# EAGLE design 3w developer v2 (EAGLE 5.10)
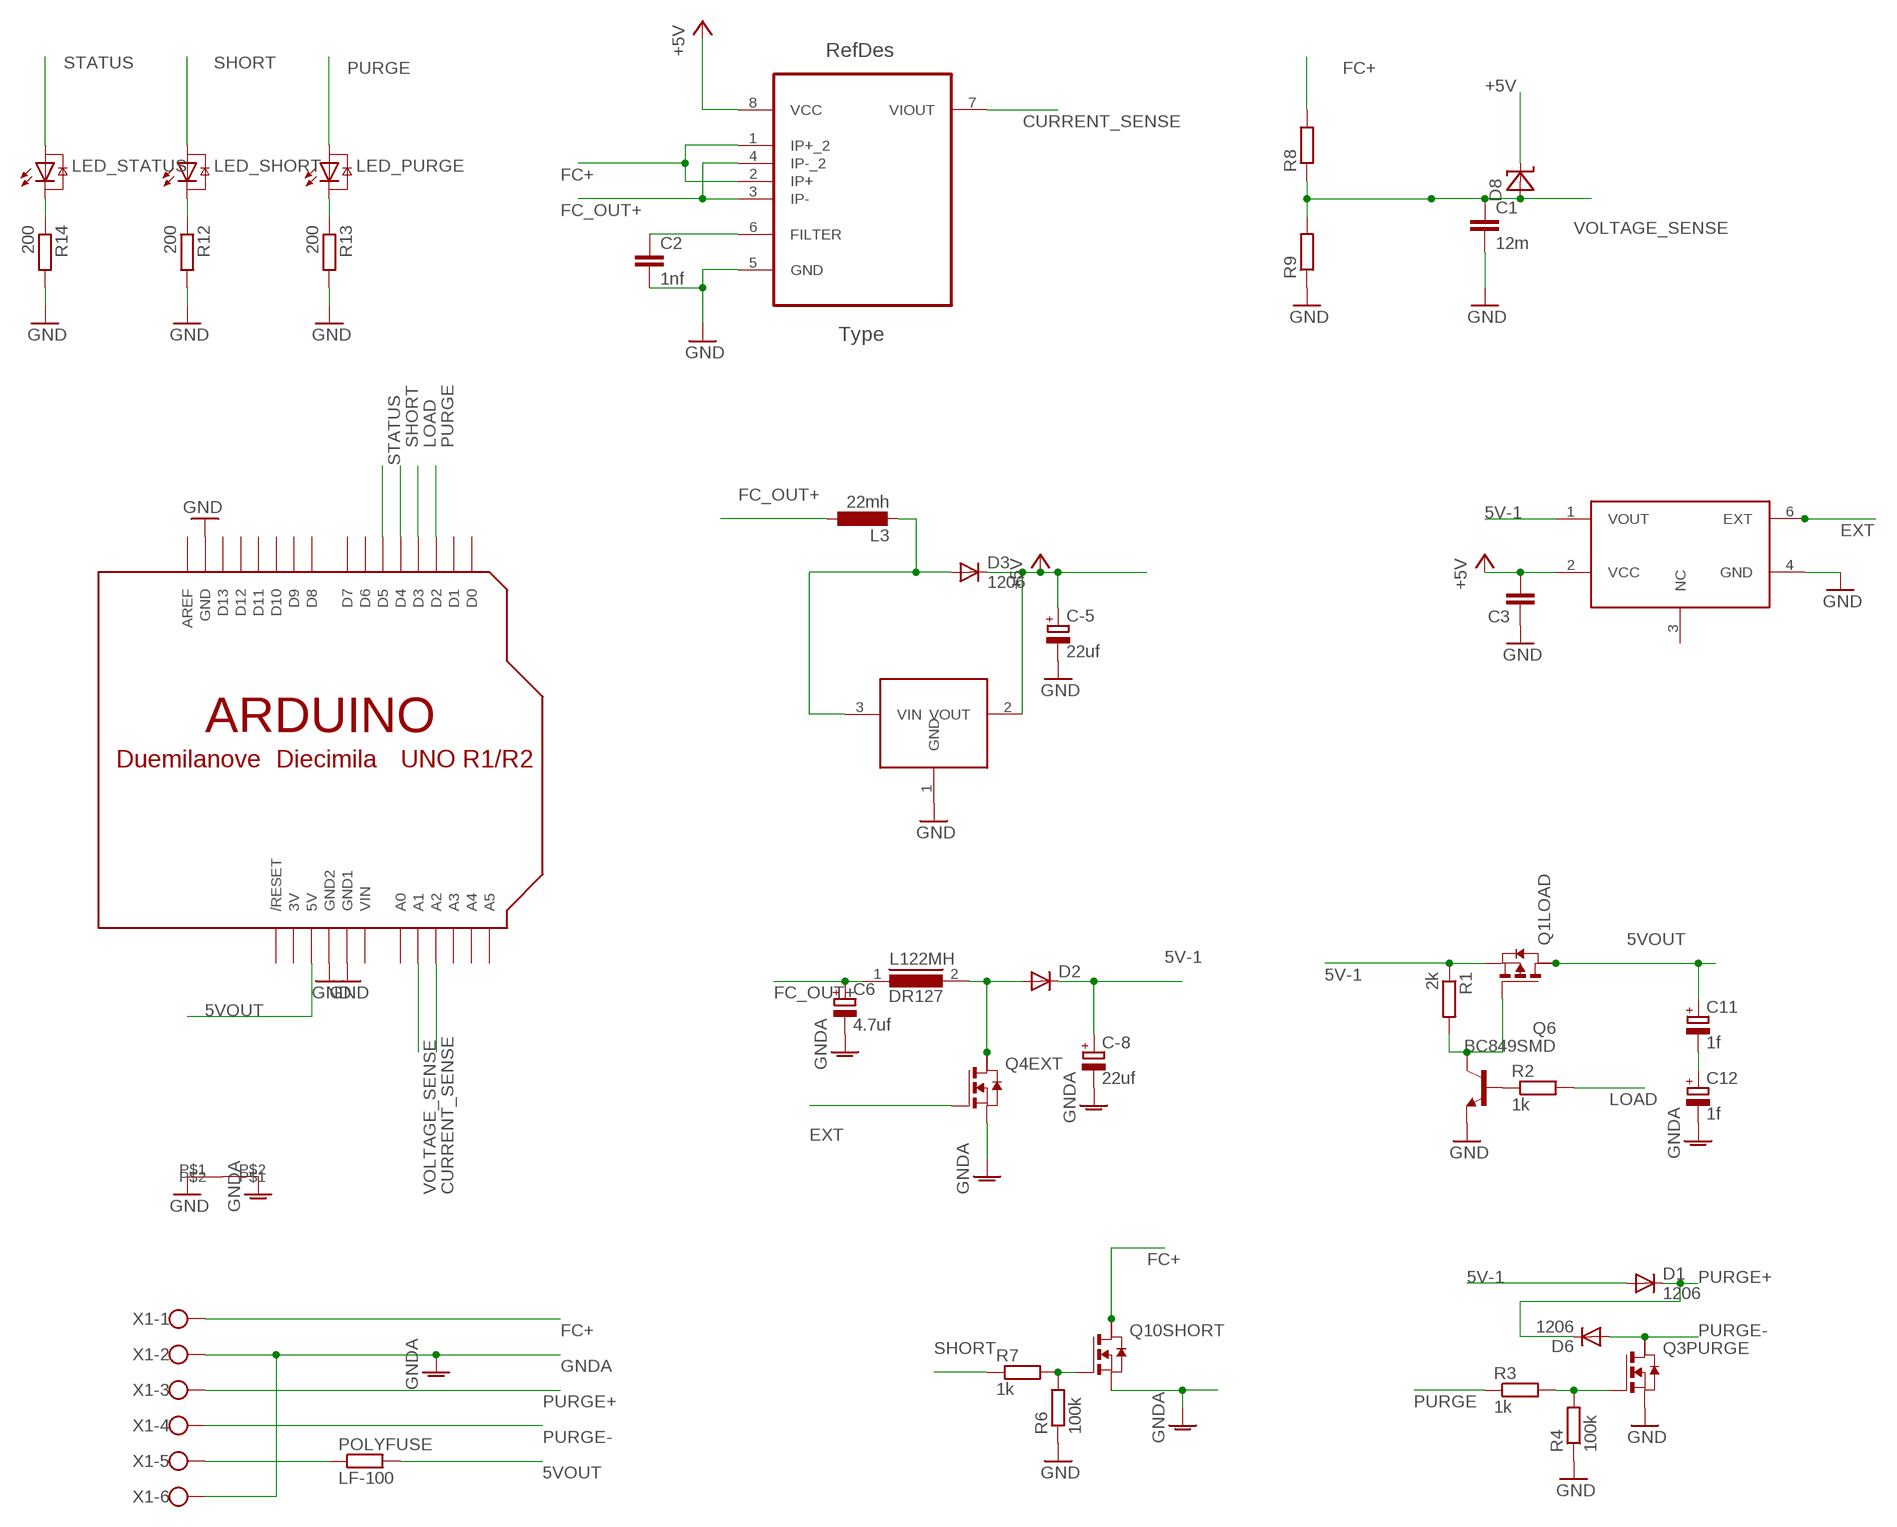
[diagram p0: schematic, sheet 1]

## Parts
C1  12m  C-EUC1206  [C1206]
C2  1nf  C-EUC1206  [C1206]
C3  C-EUC1206  [C1206]
C6  4.7uf  CPOL-EUSMCC  [SMC_C]
C11  1f  CPOL-EUE5-10.5  [E5-10,5]
C12  1f  CPOL-EUE5-10.5  [E5-10,5]
C-5  22uf  CPOL-EUSMCD  [SMC_D]
C-8  22uf  CPOL-EUSMCD  [SMC_D]
D1  1206  DIODE-GF1  [GF1]
D2  DIODE-DO214AA  [DO214AA]
D3  1206  DIODE-DO214AA  [DO214AA]
D6  1206  DIODE-GF1  [GF1]
D8  1206ZENER  [C1206]
L3  22mh  L-EU  [MURATA-45223]
L122MH  DR127  [DR127]
LED_PURGE  GM5BW96385A  [GM5BW96385A]
LED_SHORT  GM5BW96385A  [GM5BW96385A]
LED_STATUS  GM5BW96385A  [GM5BW96385A]
POLYFUSE  LF-100  [LF100]
Q1LOAD  PMOSSOT223  [SOT223]
Q3PURGE  NMOSSOT223  [SOT223]
Q4EXT  NMOSSOT223  [SOT223]
Q6  BC849SMD  [SOT23-BEC]
Q10SHORT  NMOSSOT223  [SOT223]
R1  2k  R-EU_M1206  [M1206]
R2  1k  R-EU_M1206  [M1206]
R3  1k  R-EU_M1206  [M1206]
R4  100k  R-EU_M1206  [M1206]
R6  100k  R-EU_M1206  [M1206]
R7  1k  R-EU_M1206  [M1206]
R8  R-EU_R1206  [R1206]
R9  R-EU_R1206  [R1206]
R12  200  R-EU_M1206  [M1206]
R13  200  R-EU_M1206  [M1206]
R14  200  R-EU_M1206  [M1206]
U1  ACS712ELCTR-05B-T  [SOIC127P600X175-8N]
U$1  MINIPAK-E50  [SOT23-6]
U$2  MINIPAK-7750  [SOT89]
U$3  ARDUINO-NOHOLE  [ARDUINO-NOHOLE]
U$4  SHORT  [SHORT]
X1  W237-6  [W237-6]

## Nets
5V-1: C-8.+ D1.A D2.C Q1LOAD.3(S) R1.1 U$1.1(VOUT)
5VOUT [power]: C11.+ POLYFUSE.P$4 Q1LOAD.2(D) U$3.5V
+5V [medpower]: C3.2 C-5.+ D3.C D8.CATHODE(C) U1.8(VCC) U$1.2(VCC) U$2.2(VOUT)
CURRENT_SENSE: U1.7(VIOUT) U$3.A2
EXT: Q4EXT.1(G) U$1.6(EXT)
FC+ [power]: Q10SHORT.2(D) R8.2 U1.1(IP+_2) U1.2(IP+) X1.1
FC_OUT+ [power]: C6.+ L3.P$1 L122MH.1 U1.3(IP-) U1.4(IP-_2)
GND: C1.2 C2.2 C3.1 C-5.- Q3PURGE.3(S) Q6.E R4.1 R6.1 R9.1 R12.2 R13.2 R14.2 U1.5(GND) U$1.4(GND) U$2.1(GND) U$3.GND U$3.GND1 U$3.GND2 U$4.P$1
GNDA [power]: C6.- C12.- C-8.- Q4EXT.3(S) Q10SHORT.3(S) U$4.P$2 X1.2 X1.6
LOAD: R2.2 U$3.D3
N$1: Q10SHORT.1(G) R6.2 R7.2
N$2: Q1LOAD.1(G) Q6.C R1.2
N$3: D2.A L122MH.2 Q4EXT.2(D)
N$5: Q6.B R2.1
N$6: D3.A L3.P$2 U$2.3(VIN)
N$7: Q3PURGE.1(G) R3.2 R4.2
N$8 [power]: C11.- C12.+
N$9: C2.1 U1.6(FILTER)
N$10 [power]: POLYFUSE.P$3 X1.5
N$14: LED_SHORT.C R12.1
N$15: LED_PURGE.C R13.1
N$16: LED_STATUS.C R14.1
PURGE: LED_PURGE.A R3.1 U$3.D2
PURGE+ [medpower]: D1.C D6.C X1.3
PURGE- [medpower]: D6.A Q3PURGE.2(D) X1.4
SHORT: LED_SHORT.A R7.1 U$3.D4
STATUS: LED_STATUS.A U$3.D5
VOLTAGE_SENSE: C1.1 D8.ANODE(A) R8.1 R9.2 U$3.A1
Unconnected: Q1LOAD.4(D2) Q3PURGE.4(D2) Q4EXT.4(D2) Q10SHORT.4(D2) U$1.3(NC) U$3.A0 U$3.A3 U$3.A4 U$3.A5 U$3.AREF U$3.D0 U$3.D1 U$3.D6 U$3.D7 U$3.D8 U$3.D9 U$3.D10 U$3.D11 U$3.D12 U$3.D13 U$3.RESET(/RESET)

## Power pins joined to a net without a drawn wire
3V: U$3.3V
VIN: U$3.VIN

## Library data of the parts
C1-C3 = matt rcl:C-EU: CAPACITOR, European symbol
C6 = rcl:CPOL-EU: POLARIZED CAPACITOR, European symbol
C11 C12 C-5 C-8 = matt rcl:CPOL-EU: POLARIZED CAPACITOR, European symbol
D1-D3 D6 = matt diode:DIODE-: DIODE
D8 = matt diode:1206ZENER
L3 = matt rcl:L-EU: INDUCTOR, European symbol
L122MH = inductors:DR127: High Power Density, High Efficiency, Shielded Inductors Source: coiltronics_dr_series.pdf
LED_PURGE LED_SHORT LED_STATUS = matt led:GM5BW96385A: High brightness White Color LED 2300 mcd @ IF = 20mA achieved via InGaN Blue LED chip in combination with Yellow Phosphor Source: http://document.sharpsma.com/files/GM5BW96385A.pdf
POLYFUSE = matt rcl:LF-100: polyfuse lf100 littelfuse
Q1LOAD = zetex:PMOSSOT223: MOS FET
Q3PURGE Q4EXT Q10SHORT = zetex:NMOSSOT223: MOS FET
Q6 = matt transistor-npn:BC849*: NPN Transistor
R1-R4 R6 R7 R12-R14 = resistor:R-EU_: RESISTOR, European symbol
R8 R9 = matt rcl:R-EU_: RESISTOR, European symbol
U1 = matt-allegro:ACS712ELCTR-05B-T: Linear Current Sensor; DESCRIPTION: Linear Current Sensor; MPN: ACS712ELCTR-05B-T; OC_FARNELL: 27M3644; OC_NEWARK: 1329623; PACKAGE: SOIC-8; SUPPLIER: Allegro
U$1 = matt:MINIPAK-E50
U$2 = matt:MINIPAK-7750
U$3 = adafruit:ARDUINO: Arduino Diecimila/Duemilanove Make a shield with ease, this package has all the named pins as well as the two mounting drill holes and an outline of the USB and DC power connector. The outline is on the DIMENSION layer, so if your board house uses it they will cut the outline to match. http://www.ladyada.net/library/pcb/eaglelibrary.html
U$4 = matt:SHORT
X1 = con-wago-500:W237-6: WAGO SCREW CLAMP

## Net classes
1 power: width 3 mm
2 medpower: width 1 mm

## Board
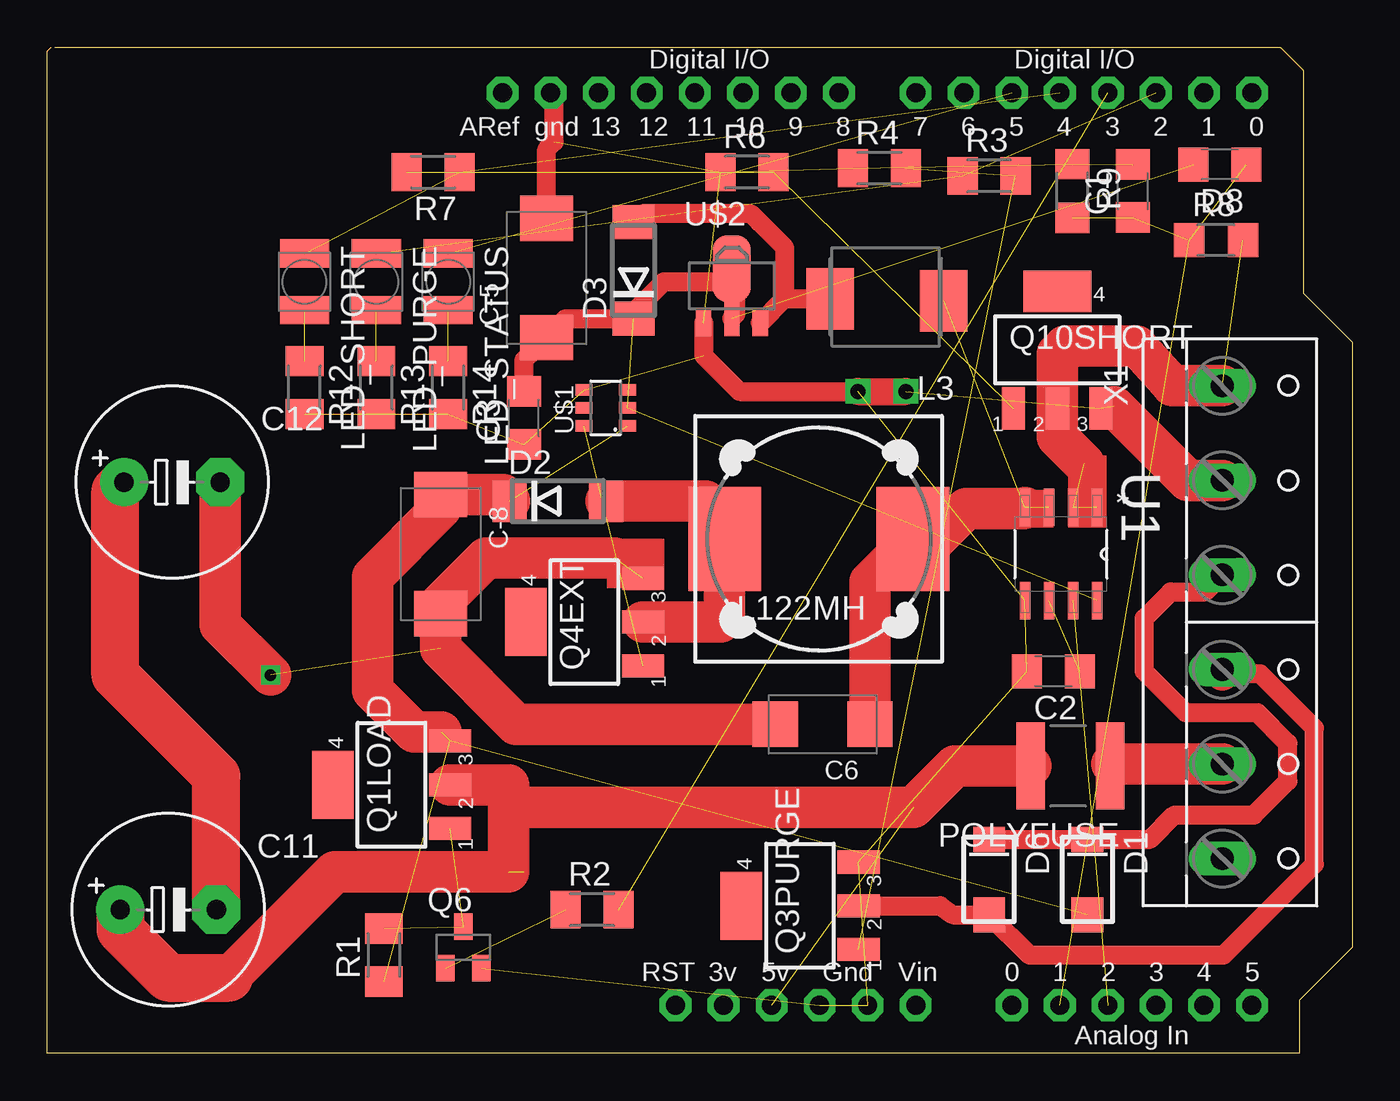
[diagram p1: board, top side]
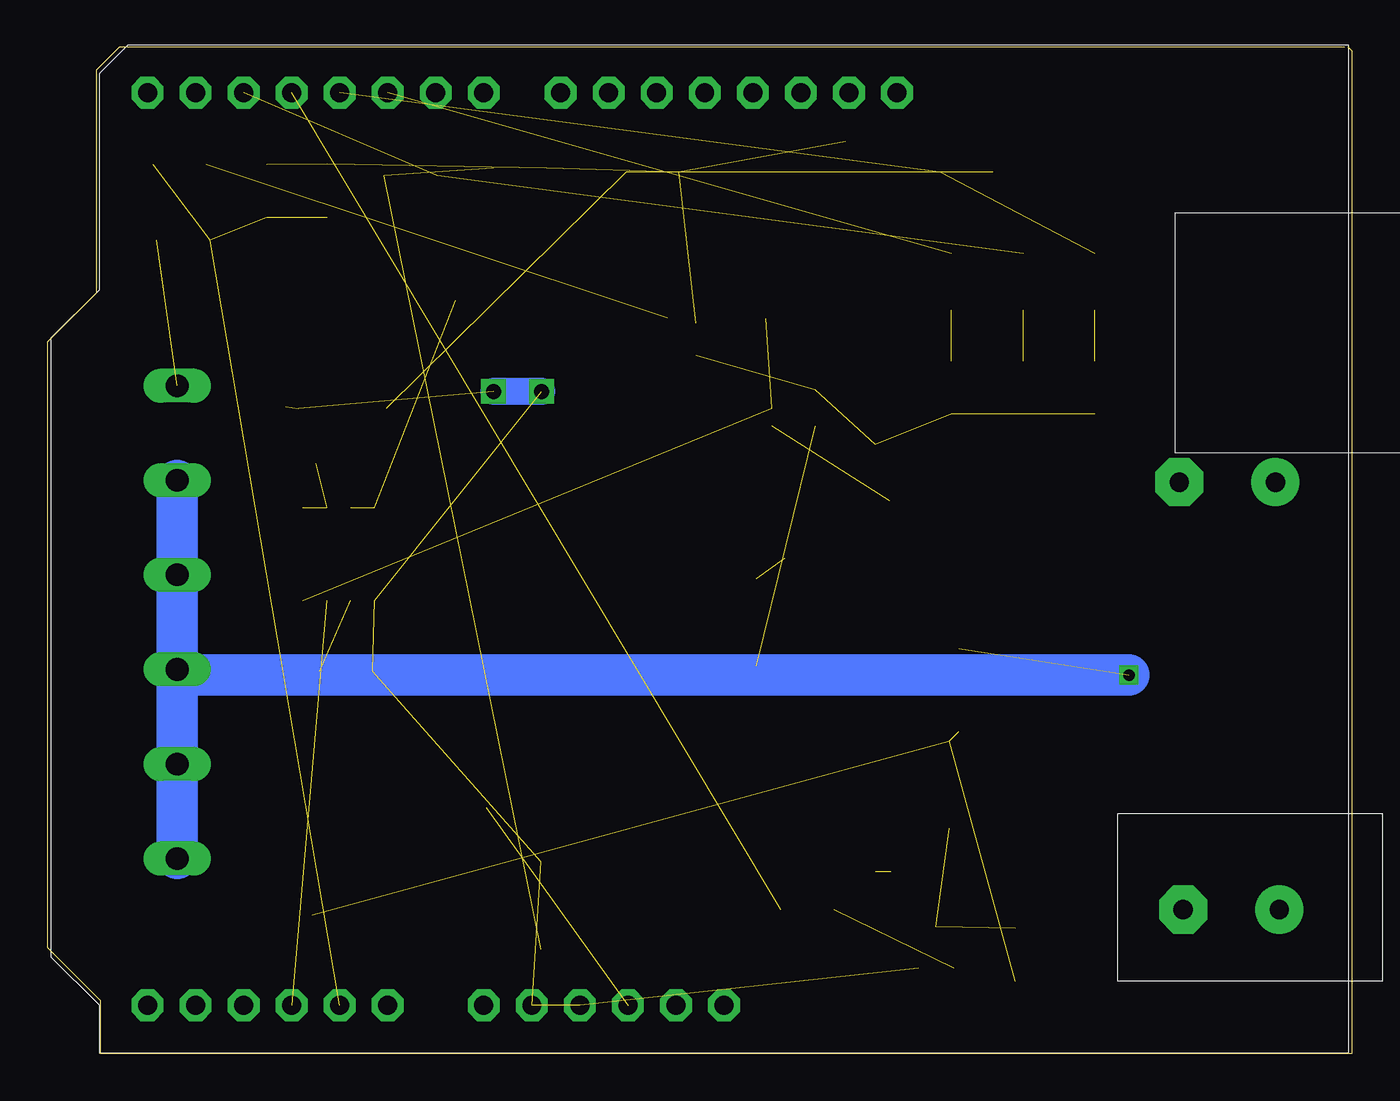
[diagram p2: board, bottom side, seen from below]

Size 69 x 53.2 mm. Coordinates in mm from the lower left corner, seen from the top.
Outline: 0.4,53.2 65.2,53.2 66.4,52 66.4,40.2 69,37.6 69,5.6 66.2,2.8 66.2,0 0,0 0,53 0.2,53.2
Copper layers (1*16): Top 0.035mm / dielectric 1.5mm / Bottom 0.035mm
Design rules "default *": minimum track width 20mil, minimum drill 24mil, track to track 10mil, track to pad 10mil, pad to pad 10mil, via to via 10mil, smd to smd 10mil, copper to edge 40mil, drill to drill 8mil, minimum pad ring 10mil, minimum via ring 8mil, stop-mask expansion 4mil, vias tented up to drill 0mil, thermal gap 10mil

### Footprints (pad centres in the part's own frame; a part is rotated, then mirrored left to right if it is on the bottom)
C1206 = smd 1.6 x 1.8: 1 -1.4,0; 2 1.4,0
SMC_C = smd 2.4 x 2.4: + -2.5,0; - 2.5,0
E5-10,5 = drill 1.016 pad 2.54 round: + -2.54,0 | drill 1.016 pad 2.54 octagon: - 2.54,0
SMC_D = smd 2.4 x 2.8: + -3.15,0; - 3.15,0
GF1 = smd 1.85 x 1.68: A 1.87,0 | smd 1.32 x 1.68: C -2.12,0
DO214AA = smd 1.8 x 2.2: A 2.55,0; C -2.55,0
C1206' = smd 1.6 x 1.8: ANODE -1.4,0; CATHODE 1.4,0
MURATA-45223 = smd 2.5 x 3.25: P$1 -3.6,0.2; P$2 2.4,0.1
DR127 = smd 3.85 x 5.5: 1 -4.975,0; 2 4.975,0
GM5BW96385A = smd 1.5 x 2.6: A -1.5,0; C 1.5,0
LF100 = smd 1.5 x 4.6: P$3 -2.2,0; P$4 2,0
SOT223 = smd 1.219 x 2.235: 1 -2.311,-3.099; 2 0,-3.099; 3 2.311,-3.099 | smd 3.6 x 2.2: 4 0,3.099
SOT23-BEC = smd 1 x 1.4: B -0.95,-1.1; C 0,1.1; E 0.95,-1.1
M1206 = smd 1.6 x 2: 1 -1.4,0; 2 1.4,0
R1206 = smd 1.6 x 1.803: 1 -1.422,0; 2 1.422,0
SOIC127P600X175-8N = smd 1.981 x 0.559: 1 -2.464,1.905; 2 -2.464,0.635; 3 -2.464,-0.635; 4 -2.464,-1.905; 5 2.464,-1.905; 6 2.464,-0.635; 7 2.464,0.635; 8 2.464,1.905
SOT23-6 = smd 0.6 x 0.9: 1 -2.22,0.12; 2 -1.27,0.12; 3 -0.32,0.12; 4 -0.32,2.42; 5 -1.27,2.42; 6 -2.22,2.42
SOT89 = smd 0.8 x 1.4: 1 -1.499,-1.981; 3 1.499,-1.981 | smd 0.8 x 1.9: 2 0,-1.727 | smd 2 x 3.5: 2.1 0,0.889
ARDUINO-NOHOLE = drill 1 pad 1.676 octagon: 3V 35.56,2.54; 5V 38.1,2.54; A0 50.8,2.54; A1 53.34,2.54; A2 55.88,2.54; A3 58.42,2.54; A4 60.96,2.54; A5 63.5,2.54; AREF 23.876,50.8; D0 63.5,50.8; D1 60.96,50.8; D2 58.42,50.8; D3 55.88,50.8; D4 53.34,50.8; D5 50.8,50.8; D6 48.26,50.8; D7 45.72,50.8; D8 41.656,50.8; D9 39.116,50.8; D10 36.576,50.8; D11 34.036,50.8; D12 31.496,50.8; D13 28.956,50.8; GND 26.416,50.8; GND1 43.18,2.54; GND2 40.64,2.54; RESET 33.02,2.54; VIN 45.72,2.54
SHORT = drill 0.8 square: P$1 -2.54,0; P$2 0,0
W237-6 = drill 1.194 long: 1 -12.5,-1.27; 2 -7.5,-1.27; 3 -2.5,-1.27; 4 2.5,-1.27; 5 7.5,-1.27; 6 12.5,-1.27

### Placement (x,y rotation side)
C1  57.4,45.6 90 top
C2  53.2,20.2 180 top
C3  25.2,33.6 90 top
C6  41,17.4 180 top
C11  6.4,7.6 0 top
C12  6.6,30.2 0 top
C-5  26.4,41 90 top
C-8  20.8,26.4 270 top
D1  55,9.2 270 top
D2  27,29.2 0 top
D3  31,41.4 90 top
D6  49.8,9.2 270 top
D8  [C1206']  62,47 180 top
L3  43.8,40 180 top
L122MH  40.8,27.2 180 top
LED_PURGE  17.4,40.8 270 top
LED_SHORT  13.6,40.8 270 top
LED_STATUS  21.2,40.8 270 top
POLYFUSE  54,15.2 180 top
Q1LOAD  18.2,14.2 90 top
Q3PURGE  39.8,7.8 90 top
Q4EXT  28.4,22.8 90 top
Q6  22,5.6 0 top
Q10SHORT  53.4,37.2 0 top
R1  17.8,5.2 90 top
R2  28.8,7.6 0 top
R3  49.8,46.4 0 top
R4  44,46.8 0 top
R6  37,46.6 0 top
R7  20.4,46.6 180 top
R8  61.8,43 0 top
R9  54.2,45.6 270 top
R12  13.6,35.2 270 top
R13  17.4,35.2 270 top
R14  21.2,35.2 270 top
U1  53.6,26.4 270 top
U$1  30.8,35.4 90 top
U$2  36.2,40.6 0 top
U$3  0.2,0 0 top
U$4  45.4,35 0 top
X1  63.4,22.8 270 top

### Tracks (layer width: path | path; a pad name or v marks a point on that pad's centre or on a via)
5V-1  (4 unrouted)
  Top 2.184: D2.C 24.1,29.55 C-8.+ 20.8,28.8 17.2,25.2 17.2,19.2 19.4,17 20.81,17
5VOUT  (2 unrouted)
  Top 2.184: Q1LOAD.2 24.4,14.2 24.4,13.2 | 9.6,4 15.2,9.6 24.4,9.6 24.4,13.2 | POLYFUSE.P$4 48,15.2 45.8,13 24.6,13 24.4,13.2
  Top 2.54: C11.+ 3.86,6.54 6.4,4 9.6,4
+5V  (3 unrouted)
  Top 1.016: C3.2 25.2,36.65 C-5.+ 27.4,38.85 D3.C 31,39.2 32.6,40.8 35.4,40.8 36.4,39.8 36.4,39.07 U$2.2
CURRENT_SENSE  (1 unrouted)
EXT  (1 unrouted)
FC+  (3 unrouted)
  Top 1.778: 53.4,37 53.8,37.4 | Q10SHORT.2 53.4,34.3
  Top 2.184: X1.1 59.5,35.3 57.6,37.4 53.8,37.4 | 53.4,34.3 53.4,37 | Q10SHORT.2 53.4,32.6 54.8,31.2
FC_OUT+  (2 unrouted)
  Top 2.184: C6.+ 43.5,24.93 L122MH.1 47,27.2 48.6,28.8 51.63,28.8 U1.4
GND  (16 unrouted)
  Top 1.016: U$2.1 34.7,36.9 36.6,35 U$4.P$1 | C-5.- 26.4,47.8 26.8,48.2 26.8,50.62 U$3.GND
GNDA  (via drill 0.6)  (4 unrouted)
  Top 2.184: 30,26.2 23.2,26.2 20.8,23.8 C-8.- 20.8,21.4 24.8,17.4 C6.- | C12.- 9.14,22.66 v11.8,20 | X1.2 60.3,30.3 56.4,34.2
  Bottom 2.184: 62.13,20 X1.6 | 62.13,20 X1.2 | v11.8,20 62.13,20
LOAD  (1 unrouted)
N$1  (2 unrouted)
N$2  (2 unrouted)
N$3
  Top 1.778: 35.8,27.17 L122MH.2
  Top 2.184: Q4EXT.2 35.6,22.8 35.8,23 35.8,27.17 | L122MH.2 35.8,27.23 35.8,28.6 35.6,28.4 34.8,29.2 D2.A
N$5  (1 unrouted)
N$6
  Top 1: 37.65,43.95 37.2,44.4 31.45,44.4 D3.A
  Top 1.016: 39.2,39.9 38.98,39.9 U$2.3 | 39.2,39.9 L3.P$2 | 37.65,43.95 39,42.6 39,40.1 39.2,39.9
N$7  (2 unrouted)
N$8
  Top 2.54: C11.- 8.94,14.66 3.6,20 3.6,29.74 C12.+
N$9  (1 unrouted)
N$10
  Top 1.778: 56.3,15.3 POLYFUSE.P$3
  Top 2.184: X1.5 56.3,15.3
N$14  (1 unrouted)
N$15  (1 unrouted)
N$16  (1 unrouted)
PURGE  (2 unrouted)
PURGE+
  Top 1.016: D6.C D1.C 58.32,11.32 59.6,12.6 63.8,12.6 65.6,14.4 65.6,16.4 64,18 60.2,18 58,20.2 58,23 59.4,24.4 61.23,24.4 X1.3
PURGE-
  Top 1.016: Q3PURGE.2 47.2,7.8 47.87,7.33 D6.A 51.93,5.2 62.2,5.2 67,10 67,17.2 64.13,20.07 62.13,20.07
  Top 1.778: 62.13,20.07 X1.4
SHORT  (2 unrouted)
STATUS  (1 unrouted)
VOLTAGE_SENSE  (4 unrouted)
(copper drawn outside any net)
  shapes: Top area x3